# Altium schematic sheet LED Matrix.SchDoc: LED Matrix Page 1
size B; CheckedBy: Lance Bantoto; Engineer: Farris Matar; Revision: 2; SheetNumber: 1; SheetTotal: 2
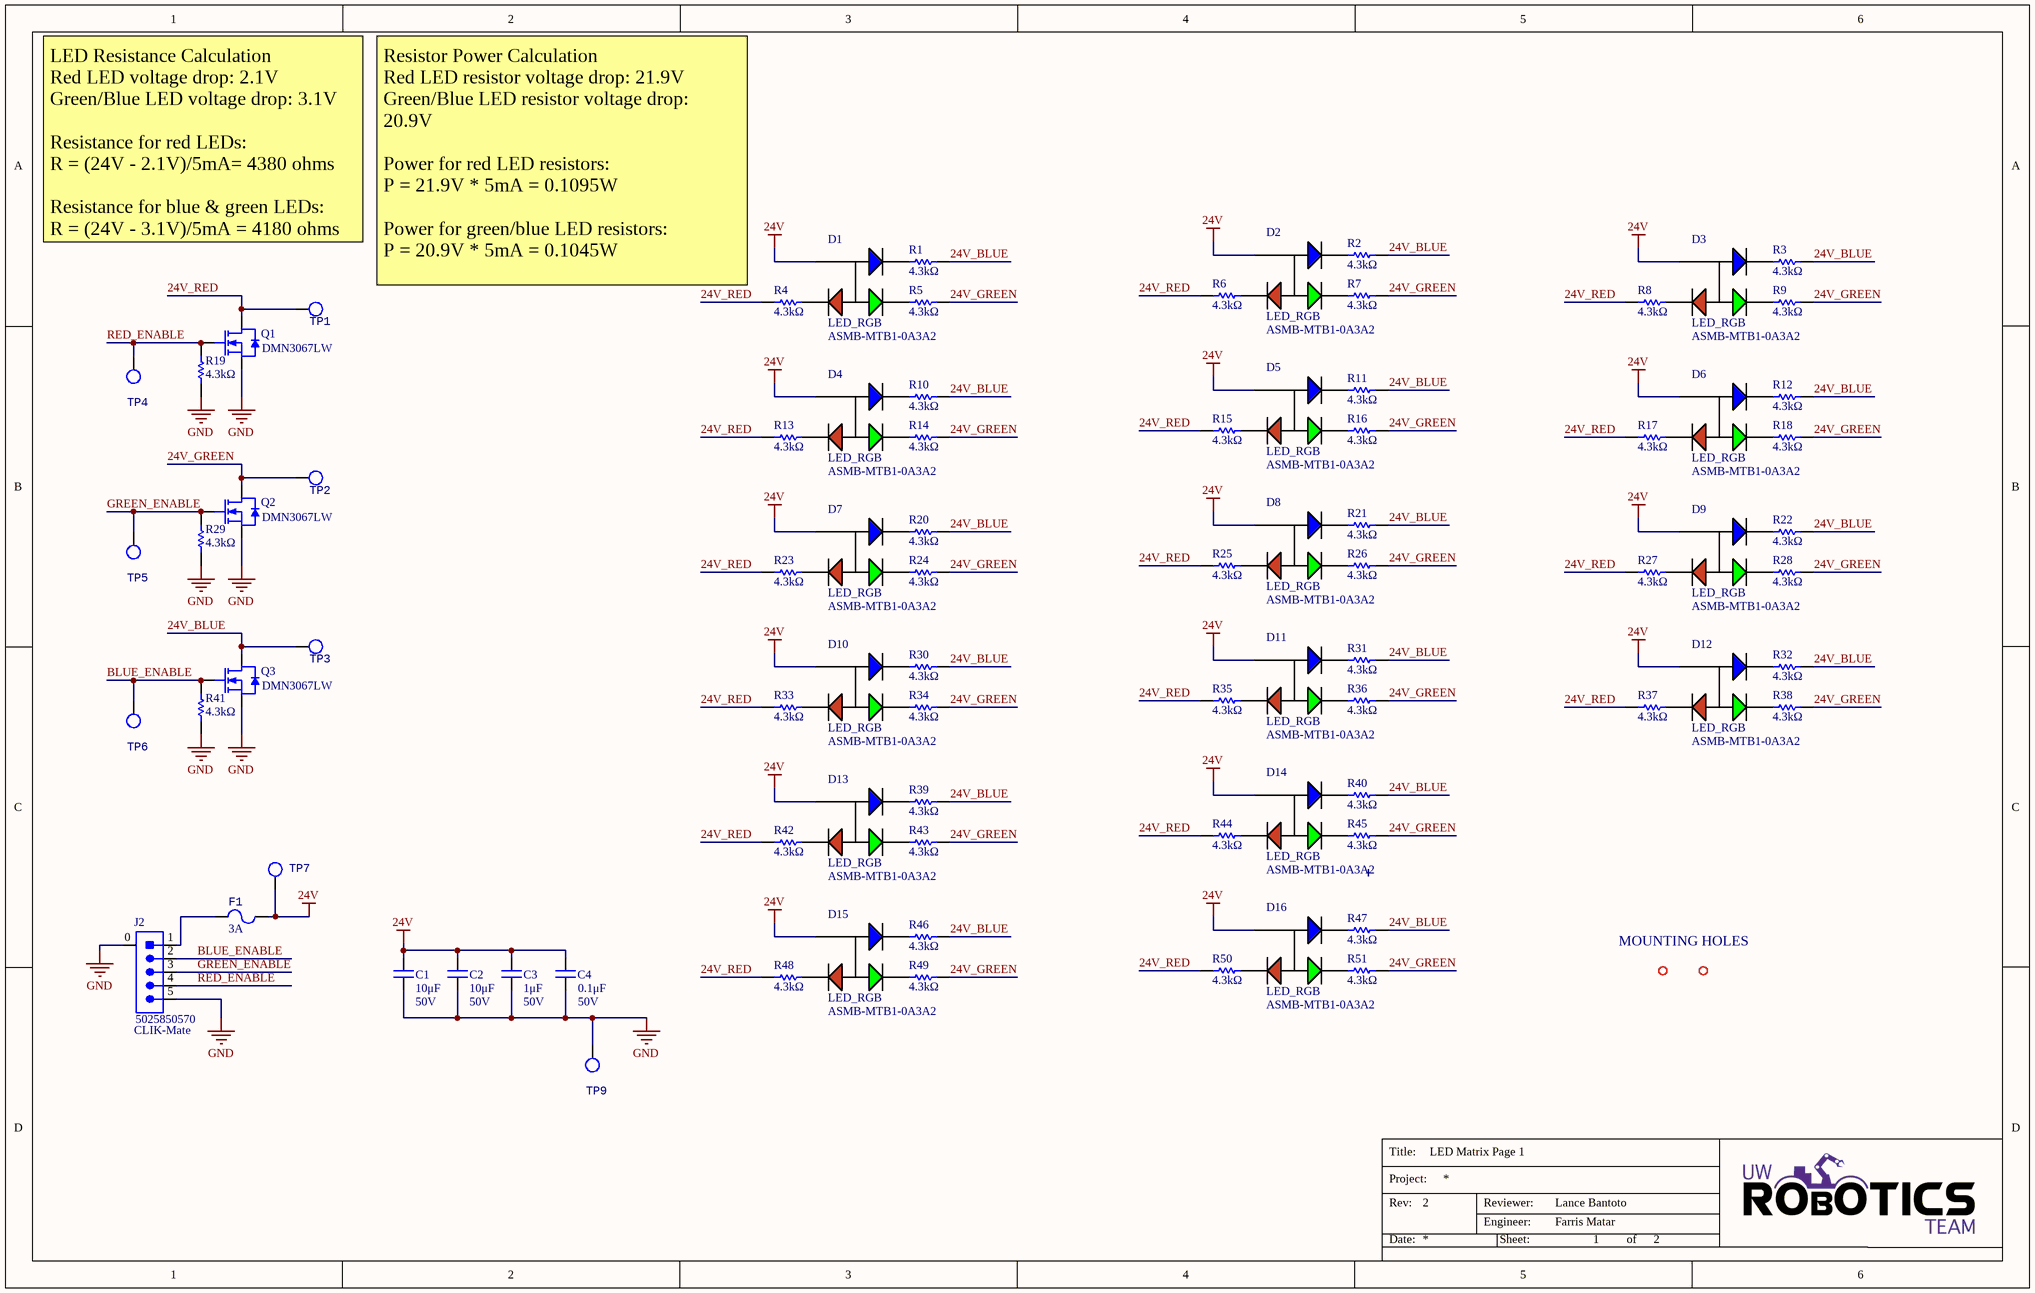
[diagram p0: LED Matrix.SchDoc]

## Parts
C1  value 10μF  Voltage Rating: 50V  [CAP1210]  (hidden comment: CAP_10uF_50V_1210)
C2  value 10μF  Voltage Rating: 50V  [CAP1210]  (hidden comment: CAP_10uF_50V_1210)
C3  value 1μF  Voltage Rating: 50V  [CAP2012]  (hidden comment: CAP_1uF_50V_0805)
C4  value 0.1μF  Voltage Rating: 50V  [CAP2012]  (hidden comment: CAP_0.1uF_50V_0805)
D1  LED_RGB  Manufacturer Part Number 1: ASMB-MTB1-0A3A2  [LED_RGB]
D2  LED_RGB  Manufacturer Part Number 1: ASMB-MTB1-0A3A2  [LED_RGB]
D3  LED_RGB  Manufacturer Part Number 1: ASMB-MTB1-0A3A2  [LED_RGB]
D4  LED_RGB  Manufacturer Part Number 1: ASMB-MTB1-0A3A2  [LED_RGB]
D5  LED_RGB  Manufacturer Part Number 1: ASMB-MTB1-0A3A2  [LED_RGB]
D6  LED_RGB  Manufacturer Part Number 1: ASMB-MTB1-0A3A2  [LED_RGB]
D7  LED_RGB  Manufacturer Part Number 1: ASMB-MTB1-0A3A2  [LED_RGB]
D8  LED_RGB  Manufacturer Part Number 1: ASMB-MTB1-0A3A2  [LED_RGB]
D9  LED_RGB  Manufacturer Part Number 1: ASMB-MTB1-0A3A2  [LED_RGB]
D10  LED_RGB  Manufacturer Part Number 1: ASMB-MTB1-0A3A2  [LED_RGB]
D11  LED_RGB  Manufacturer Part Number 1: ASMB-MTB1-0A3A2  [LED_RGB]
D12  LED_RGB  Manufacturer Part Number 1: ASMB-MTB1-0A3A2  [LED_RGB]
D13  LED_RGB  Manufacturer Part Number 1: ASMB-MTB1-0A3A2  [LED_RGB]
D14  LED_RGB  Manufacturer Part Number 1: ASMB-MTB1-0A3A2  [LED_RGB]
D15  LED_RGB  Manufacturer Part Number 1: ASMB-MTB1-0A3A2  [LED_RGB]
D16  LED_RGB  Manufacturer Part Number 1: ASMB-MTB1-0A3A2  [LED_RGB]
F1  Current Rating: 3A  [FUSE_1206]  (hidden comment: FUSE_3A_1206)
J2  Manufacturer Part Number 1: 5025850570  Family: CLIK-Mate  [MOLEX-5025850570]  (hidden comment: CON_5M_SM_RA)
MH1  MOUNTING_HOLES  [MOUNTING_HOLE]  (value not drawn)
MH2  MOUNTING_HOLES  [MOUNTING_HOLE]  (value not drawn)
Q1  Manufacturer Part Number 1: DMN3067LW  [NMOS_SOT-323]  (hidden comment: NMOS_30V_2.6A)
Q2  Manufacturer Part Number 1: DMN3067LW  [NMOS_SOT-323]  (hidden comment: NMOS_30V_2.6A)
Q3  Manufacturer Part Number 1: DMN3067LW  [NMOS_SOT-323]  (hidden comment: NMOS_30V_2.6A)
R1  Resistance: 4.3kΩ  [RES1210]  (hidden comment: RES_4.3kΩ_1210_5%)
R2  Resistance: 4.3kΩ  [RES1210]  (hidden comment: RES_4.3kΩ_1210_5%)
R3  Resistance: 4.3kΩ  [RES1210]  (hidden comment: RES_4.3kΩ_1210_5%)
R4  Resistance: 4.3kΩ  [RES1210]  (hidden comment: RES_4.3kΩ_1210_5%)
R5  Resistance: 4.3kΩ  [RES1210]  (hidden comment: RES_4.3kΩ_1210_5%)
R6  Resistance: 4.3kΩ  [RES1210]  (hidden comment: RES_4.3kΩ_1210_5%)
R7  Resistance: 4.3kΩ  [RES1210]  (hidden comment: RES_4.3kΩ_1210_5%)
R8  Resistance: 4.3kΩ  [RES1210]  (hidden comment: RES_4.3kΩ_1210_5%)
R9  Resistance: 4.3kΩ  [RES1210]  (hidden comment: RES_4.3kΩ_1210_5%)
R10  Resistance: 4.3kΩ  [RES1210]  (hidden comment: RES_4.3kΩ_1210_5%)
R11  Resistance: 4.3kΩ  [RES1210]  (hidden comment: RES_4.3kΩ_1210_5%)
R12  Resistance: 4.3kΩ  [RES1210]  (hidden comment: RES_4.3kΩ_1210_5%)
R13  Resistance: 4.3kΩ  [RES1210]  (hidden comment: RES_4.3kΩ_1210_5%)
R14  Resistance: 4.3kΩ  [RES1210]  (hidden comment: RES_4.3kΩ_1210_5%)
R15  Resistance: 4.3kΩ  [RES1210]  (hidden comment: RES_4.3kΩ_1210_5%)
R16  Resistance: 4.3kΩ  [RES1210]  (hidden comment: RES_4.3kΩ_1210_5%)
R17  Resistance: 4.3kΩ  [RES1210]  (hidden comment: RES_4.3kΩ_1210_5%)
R18  Resistance: 4.3kΩ  [RES1210]  (hidden comment: RES_4.3kΩ_1210_5%)
R19  Resistance: 4.3kΩ  [RES1210]  (hidden comment: RES_4.3kΩ_1210_5%)
R20  Resistance: 4.3kΩ  [RES1210]  (hidden comment: RES_4.3kΩ_1210_5%)
R21  Resistance: 4.3kΩ  [RES1210]  (hidden comment: RES_4.3kΩ_1210_5%)
R22  Resistance: 4.3kΩ  [RES1210]  (hidden comment: RES_4.3kΩ_1210_5%)
R23  Resistance: 4.3kΩ  [RES1210]  (hidden comment: RES_4.3kΩ_1210_5%)
R24  Resistance: 4.3kΩ  [RES1210]  (hidden comment: RES_4.3kΩ_1210_5%)
R25  Resistance: 4.3kΩ  [RES1210]  (hidden comment: RES_4.3kΩ_1210_5%)
R26  Resistance: 4.3kΩ  [RES1210]  (hidden comment: RES_4.3kΩ_1210_5%)
R27  Resistance: 4.3kΩ  [RES1210]  (hidden comment: RES_4.3kΩ_1210_5%)
R28  Resistance: 4.3kΩ  [RES1210]  (hidden comment: RES_4.3kΩ_1210_5%)
R29  Resistance: 4.3kΩ  [RES1210]  (hidden comment: RES_4.3kΩ_1210_5%)
R30  Resistance: 4.3kΩ  [RES1210]  (hidden comment: RES_4.3kΩ_1210_5%)
R31  Resistance: 4.3kΩ  [RES1210]  (hidden comment: RES_4.3kΩ_1210_5%)
R32  Resistance: 4.3kΩ  [RES1210]  (hidden comment: RES_4.3kΩ_1210_5%)
R33  Resistance: 4.3kΩ  [RES1210]  (hidden comment: RES_4.3kΩ_1210_5%)
R34  Resistance: 4.3kΩ  [RES1210]  (hidden comment: RES_4.3kΩ_1210_5%)
R35  Resistance: 4.3kΩ  [RES1210]  (hidden comment: RES_4.3kΩ_1210_5%)
R36  Resistance: 4.3kΩ  [RES1210]  (hidden comment: RES_4.3kΩ_1210_5%)
R37  Resistance: 4.3kΩ  [RES1210]  (hidden comment: RES_4.3kΩ_1210_5%)
R38  Resistance: 4.3kΩ  [RES1210]  (hidden comment: RES_4.3kΩ_1210_5%)
R39  Resistance: 4.3kΩ  [RES1210]  (hidden comment: RES_4.3kΩ_1210_5%)
R40  Resistance: 4.3kΩ  [RES1210]  (hidden comment: RES_4.3kΩ_1210_5%)
R41  Resistance: 4.3kΩ  [RES1210]  (hidden comment: RES_4.3kΩ_1210_5%)
R42  Resistance: 4.3kΩ  [RES1210]  (hidden comment: RES_4.3kΩ_1210_5%)
R43  Resistance: 4.3kΩ  [RES1210]  (hidden comment: RES_4.3kΩ_1210_5%)
R44  Resistance: 4.3kΩ  [RES1210]  (hidden comment: RES_4.3kΩ_1210_5%)
R45  Resistance: 4.3kΩ  [RES1210]  (hidden comment: RES_4.3kΩ_1210_5%)
R46  Resistance: 4.3kΩ  [RES1210]  (hidden comment: RES_4.3kΩ_1210_5%)
R47  Resistance: 4.3kΩ  [RES1210]  (hidden comment: RES_4.3kΩ_1210_5%)
R48  Resistance: 4.3kΩ  [RES1210]  (hidden comment: RES_4.3kΩ_1210_5%)
R49  Resistance: 4.3kΩ  [RES1210]  (hidden comment: RES_4.3kΩ_1210_5%)
R50  Resistance: 4.3kΩ  [RES1210]  (hidden comment: RES_4.3kΩ_1210_5%)
R51  Resistance: 4.3kΩ  [RES1210]  (hidden comment: RES_4.3kΩ_1210_5%)
TP1  TESTPOINT_LOOP  [TESTPOINT_LOOP]  (value not drawn)
TP2  TESTPOINT_LOOP  [TESTPOINT_LOOP]  (value not drawn)
TP3  TESTPOINT_LOOP  [TESTPOINT_LOOP]  (value not drawn)
TP4  TESTPOINT_LOOP  [TESTPOINT_LOOP]  (value not drawn)
TP5  TESTPOINT_LOOP  [TESTPOINT_LOOP]  (value not drawn)
TP6  TESTPOINT_LOOP  [TESTPOINT_LOOP]  (value not drawn)
TP7  TESTPOINT_LOOP  [TESTPOINT_LOOP]  (value not drawn)
TP9  TESTPOINT_LOOP  [TESTPOINT_LOOP]  (value not drawn)

## Nets
24V: C1.2 C2.2 C3.1 C4.2 D1.4(COMMON_ANODE) D2.4(COMMON_ANODE) D3.4(COMMON_ANODE) D4.4(COMMON_ANODE) D5.4(COMMON_ANODE) D6.4(COMMON_ANODE) D7.4(COMMON_ANODE) D8.4(COMMON_ANODE) D9.4(COMMON_ANODE) D10.4(COMMON_ANODE) D11.4(COMMON_ANODE) D12.4(COMMON_ANODE) D13.4(COMMON_ANODE) D14.4(COMMON_ANODE) D15.4(COMMON_ANODE) D16.4(COMMON_ANODE) F1.1 TP7.1
GND: C1.1 C2.1 C3.2 C4.1 J2.0 J2.5 Q1.2(SOURCE) Q2.2(SOURCE) Q3.2(SOURCE) R19.1 R29.1 R41.1 TP9.1
24V_BLUE: Q3.3(DRAIN) R1.2 R2.2 R3.2 R10.2 R11.2 R12.2 R20.1 R21.1 R22.1 R30.2 R31.2 R32.2 R39.1 R40.2 R46.2 R47.2 TP3.1
24V_GREEN: Q2.3(DRAIN) R5.2 R7.2 R9.2 R14.2 R16.2 R18.2 R24.2 R26.2 R28.2 R34.2 R36.2 R38.2 R43.2 R45.2 R49.2 R51.2 TP2.1
24V_RED: Q1.3(DRAIN) R4.1 R6.1 R8.1 R13.1 R15.1 R17.1 R23.2 R25.1 R27.1 R33.1 R35.1 R37.1 R42.1 R44.1 R48.1 R50.1 TP1.1
BLUE_ENABLE: J2.2 Q3.1(GATE) R41.2 TP6.1
GREEN_ENABLE: J2.3 Q2.1(GATE) R29.2 TP5.1
RED_ENABLE: J2.4 Q1.1(GATE) R19.2 TP4.1
NetD1_1: D1.1(CATHODE_(RED)) R4.2
NetD1_2: D1.2(CATHODE_(GREEN)) R5.1
NetD1_3: D1.3(CATHODE_(BLUE)) R1.1
NetD2_1: D2.1(CATHODE_(RED)) R6.2
NetD2_2: D2.2(CATHODE_(GREEN)) R7.1
NetD2_3: D2.3(CATHODE_(BLUE)) R2.1
NetD3_1: D3.1(CATHODE_(RED)) R8.2
NetD3_2: D3.2(CATHODE_(GREEN)) R9.1
NetD3_3: D3.3(CATHODE_(BLUE)) R3.1
NetD4_1: D4.1(CATHODE_(RED)) R13.2
NetD4_2: D4.2(CATHODE_(GREEN)) R14.1
NetD4_3: D4.3(CATHODE_(BLUE)) R10.1
NetD5_1: D5.1(CATHODE_(RED)) R15.2
NetD5_2: D5.2(CATHODE_(GREEN)) R16.1
NetD5_3: D5.3(CATHODE_(BLUE)) R11.1
NetD6_1: D6.1(CATHODE_(RED)) R17.2
NetD6_2: D6.2(CATHODE_(GREEN)) R18.1
NetD6_3: D6.3(CATHODE_(BLUE)) R12.1
NetD7_1: D7.1(CATHODE_(RED)) R23.1
NetD7_2: D7.2(CATHODE_(GREEN)) R24.1
NetD7_3: D7.3(CATHODE_(BLUE)) R20.2
NetD8_1: D8.1(CATHODE_(RED)) R25.2
NetD8_2: D8.2(CATHODE_(GREEN)) R26.1
NetD8_3: D8.3(CATHODE_(BLUE)) R21.2
NetD9_1: D9.1(CATHODE_(RED)) R27.2
NetD9_2: D9.2(CATHODE_(GREEN)) R28.1
NetD9_3: D9.3(CATHODE_(BLUE)) R22.2
NetD10_1: D10.1(CATHODE_(RED)) R33.2
NetD10_2: D10.2(CATHODE_(GREEN)) R34.1
NetD10_3: D10.3(CATHODE_(BLUE)) R30.1
NetD11_1: D11.1(CATHODE_(RED)) R35.2
NetD11_2: D11.2(CATHODE_(GREEN)) R36.1
NetD11_3: D11.3(CATHODE_(BLUE)) R31.1
NetD12_1: D12.1(CATHODE_(RED)) R37.2
NetD12_2: D12.2(CATHODE_(GREEN)) R38.1
NetD12_3: D12.3(CATHODE_(BLUE)) R32.1
NetD13_1: D13.1(CATHODE_(RED)) R42.2
NetD13_2: D13.2(CATHODE_(GREEN)) R43.1
NetD13_3: D13.3(CATHODE_(BLUE)) R39.2
NetD14_1: D14.1(CATHODE_(RED)) R44.2
NetD14_2: D14.2(CATHODE_(GREEN)) R45.1
NetD14_3: D14.3(CATHODE_(BLUE)) R40.1
NetD15_1: D15.1(CATHODE_(RED)) R48.2
NetD15_2: D15.2(CATHODE_(GREEN)) R49.1
NetD15_3: D15.3(CATHODE_(BLUE)) R46.1
NetD16_1: D16.1(CATHODE_(RED)) R50.2
NetD16_2: D16.2(CATHODE_(GREEN)) R51.1
NetD16_3: D16.3(CATHODE_(BLUE)) R47.1
NetF1_2: F1.2 J2.1

## Notes on the sheet
- LED Resistance Calculation
  Red LED voltage drop: 2.1V
  Green/Blue LED voltage drop: 3.1V
  Resistance for red LEDs:
  R = (24V - 2.1V)/5mA= 4380 ohms
  Resistance for blue & green LEDs:
  R = (24V - 3.1V)/5mA = 4180 ohms
- (near R4) Resistor Power Calculation
  Red LED resistor voltage drop: 21.9V
  Green/Blue LED resistor voltage drop: 20.9V
  Power for red LED resistors:
  P = 21.9V * 5mA = 0.1095W
  Power for green/blue LED resistors:
  P = 20.9V * 5mA = 0.1045W
  All resistors used in this schematic are 1210
- MOUNTING HOLES
- Title:
- Project:
- Date:
- Rev:
- Reviewer:
- Engineer:
- Sheet:
- of

## Library data of the parts
C1 C2 = CAP_10uF_50V_1210: CAP CER 10UF 50V X7R 1210; Manufacturer 1: Murata Electronics; Manufacturer Part Number 1: GRM32ER71H106MA12L; Supplier 1: Digi-Key; Supplier Part Number 1: 490-12775-1-ND; Dielectric: X7R
C3 = CAP_1uF_50V_0805: CAP CER 1UF 50V X7R 0805; Manufacturer Part Number 1: CL21B105KBFNNNG; Manufacturer 1: Samsung Electro-Mechanics; Package/Footprint: 0805; Supplier 1: Digi-Key; Supplier Part Number 1: 1276-6470-1-ND; Mounting Type: SMD; LCSC Part #: C28323
C4 = CAP_0.1uF_50V_0805: CAP CER 0.1UF 50V X7R 0805; Manufacturer 1: Murata Electronics; Manufacturer Part Number 1: GCM21BR71H104KA37K; Package/Footprint: 0805; Supplier 1: Digi-Key; Dielectric: X7R; Supplier Part Number 1: 490-8049-1-ND; Mounting Type: SMD; LCSC Part #: C49678
D1-D16 = LED_RGB: LED RGB DIFFUSED 4PLCC SMD; Manufacturer 1: Broadcom; Color: Blue,Green,Red; Lens Color: White; Viewing Angle: 115°; Lens Style: Round; Luminous Intensity: 350mcd; Dominant Wavelength: 470nm; Forward Voltage: 3.1V; Test Current: 20mA; Package/Footprint: 4-PLCC; Supplier 1: Digi-Key; Number of Pins: 4; Lens Transparency: Diffused; Supplier Part Number 1: 516-3280-1-ND; Mounting Type: SMD
F1 = FUSE_3A_1206: FUSE BOARD MNT 3A 32VAC/VDC 1206; Manufacturer 1: Littelfuse; Manufacturer Part Number 1: 0466003.NR; Package/Footprint: 1206; Supplier 1: Digi-Key; Supplier Part Number 1: F1458CT-ND; Mounting Type: SMD
J2 = CON_5M_SM_RA: CONN HEADER SMD RIGHT ANGLE 1.5MM PITCH; Manufacturer 1: Molex; Current Rating: 2A; Supplier Part Number 1: WM14469CT-ND; Supplier 1: Digi-Key; Mounting Type: SMD; Package/Footprint: SMD; Orientation: Right Angle
MH1 MH2 = MOUNTING_HOLES: 6cm x 6cm
Q1-Q3 = NMOS_30V_2.6A: MOSFET N-CH 30V 2.6A SOT-323; Manufacturer 1: Diodes Incorporated; Vgs (Max): ±12V; Supplier 1: Digi-Key; Supplier Part Number 1: DMN3067LW-7DICT-ND; Mounting Type: SMD; Package/Footprint: SOT-323; Vdss: 30V; Id: 2.6A
R1-R51 = RES_4.3kΩ_1210_5%: RES 4.3K OHM 5% 1/2W 1210; Manufacturer 1: Panasonic; Manufacturer Part Number 1: ERJ-14YJ432U; Supplier 1: Digi-Key; Tolerance: 5%; Supplier Part Number 1: P4.3KVCT-ND; Package: 1210; Mounting Type: SMD
TP1-TP7 TP9 = TESTPOINT_LOOP: TESTPOINT THRUHOLE; Manufacturer 1: Keystone Electronics; Manufacturer Part Number 1: 5002; Package/Footprint: TH; Supplier Part Number 1: 36-5002-ND; Supplier 1: Digi-Key; Mounting Type: TH